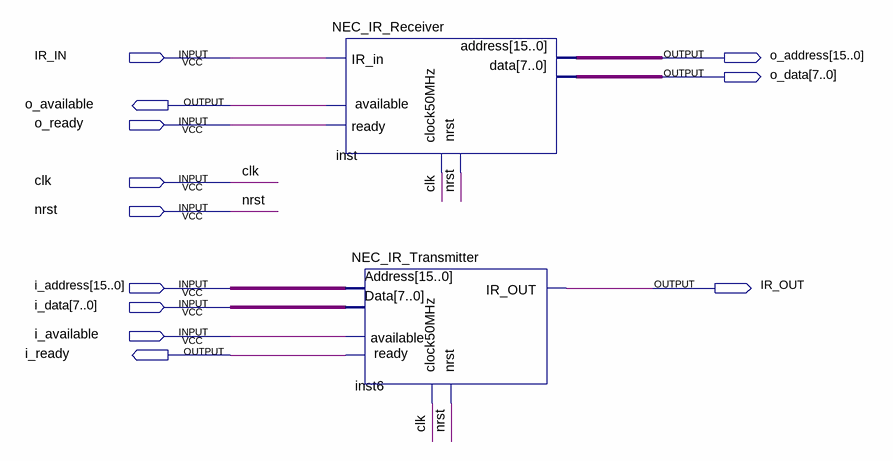
[diagram p0: schematic sheet]
// Quartus schematic NEC_IR_Transceiver.bdf as structural Verilog: 2 symbols, 12 pins
module NEC_IR_Transceiver (
  input  IR_IN,
  input  o_ready,
  input  clk,
  input  nrst,
  input  [15:0] i_address,
  input  [7:0] i_data,
  input  i_available,
  output [15:0] o_address,
  output [7:0] o_data,
  output o_available,
  output IR_OUT,
  output i_ready
);

  NEC_IR_Receiver inst (
    .IR_in(IR_IN), .clock50MHz(clk), .nrst(nrst), .ready(o_ready), .address(o_address), .data(o_data),
    .available(o_available));
  NEC_IR_Transmitter inst6 (
    .Address(i_address), .Data(i_data), .clock50MHz(clk), .nrst(nrst), .available(i_available),
    .IR_OUT(IR_OUT), .ready(i_ready));
endmodule
